# Altium schematic sheet 3_bootleg-2-mcu.SchDoc
size A4
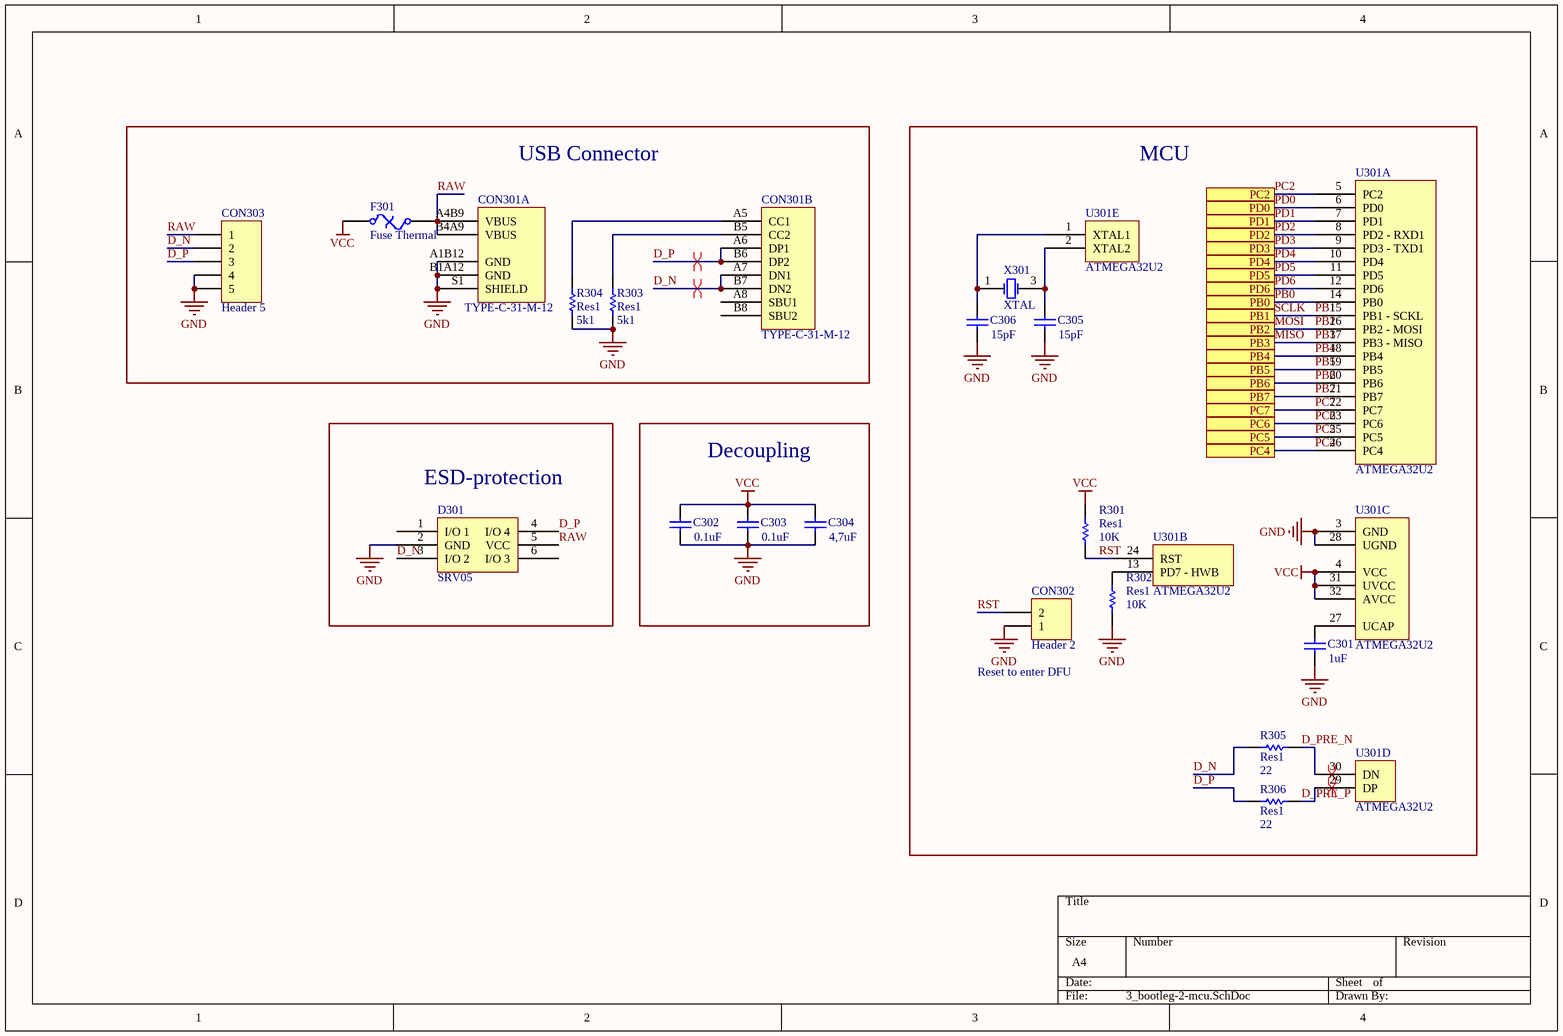
[diagram p0: 3_bootleg-2-mcu.SchDoc]

## Parts
C301  value 1uF  [C0603[1608]]
C302  value 0.1uF  [C0603[1608]]
C303  value 0.1uF  [C0603[1608]]
C304  value 4,7uF  [C0603[1608]]
C305  value 15pF  [C0603[1608]]
C306  value 15pF  [C0603[1608]]
CON301  TYPE-C-31-M-12  [TYPE-C-31-M-12]  (parts A,B of 2)
CON302  Header 2  [HDR1X2]  (no BOM)
CON303  Header 5  [JST SM04B-SRSS-TB]
D301  SRV05  [SOT-23-6]
F301  Fuse Thermal  [C1206[3216]]
R301  Res1  value 10K  [R0603[1608]]
R302  Res1  value 10K  [R0603[1608]]
R303  Res1  value 5k1  [R0603[1608]]
R304  Res1  value 5k1  [R0603[1608]]
R305  Res1  value 22  [R0603[1608]]
R306  Res1  value 22  [R0603[1608]]
U301  ATMEGA32U2  [ATMEGA32U2-COMBO]  (parts A,B,C,D,E of 5)
X301  XTAL  [XTAL-3225]

## Blocks framed on the sheet
USB Connector: CON301 CON303 F301 R303 R304
MCU: C301 C305 C306 CON302 R301 R302 R305 R306 U301 X301
ESD-protection: D301
Decoupling: C302-C304

## Ports
PB0, PB1, PB2, PB3, PB4, PB5, PB6, PB7, PC2, PC4, PC5, PC6, PC7, PD0, PD1, PD2, PD3, PD4, PD5, PD6

## Nets
GND: C301.1 C302.1 C303.1 C304.1 C305.1 C306.1 CON301.A1B12(GND) CON301.B1A12(GND) CON301.S1(SHIELD) CON302.1 CON303.4 CON303.5 D301.2(GND) R302.2 R303.2 R304.2 U301.3(GND) U301.28(UGND) X301.2(GND) X301.4(GND)
VCC: C302.2 C303.2 C304.2 F301.1 R301.1 U301.4(VCC) U301.31(UVCC) U301.32(AVCC)
D_N: CON301.A7(DN1) CON301.B7(DN2) CON303.2 D301.3(I/O_2) R305.2
D_P: CON301.A6(DP1) CON301.B6(DP2) CON303.3 D301.4(I/O_4) R306.2
D_PRE_N: R305.1 U301.30(DN)
D_PRE_P: R306.1 U301.29(DP)
MISO: U301.17(PB3_-_MISO) ; port PB3  [also labelled PB3]
MOSI: U301.16(PB2_-_MOSI) ; port PB2  [also labelled PB2]
PB0: U301.14(PB0) ; port PB0
PB1: U301.15(PB1_-_SCKL) ; port PB1  [also labelled SCLK]
PB4: U301.18(PB4) ; port PB4
PB5: U301.19(PB5) ; port PB5
PB6: U301.20(PB6) ; port PB6
PB7: U301.21(PB7) ; port PB7
PC2: U301.5(PC2) ; port PC2
PC4: U301.26(PC4) ; port PC4
PC5: U301.25(PC5) ; port PC5
PC6: U301.23(PC6) ; port PC6
PC7: U301.22(PC7) ; port PC7
PD0: U301.6(PD0) ; port PD0
PD1: U301.7(PD1) ; port PD1
PD2: U301.8(PD2_-_RXD1) ; port PD2
PD3: U301.9(PD3_-_TXD1) ; port PD3
PD4: U301.10(PD4) ; port PD4
PD5: U301.11(PD5) ; port PD5
PD6: U301.12(PD6) ; port PD6
RAW: CON301.A4B9(VBUS) CON301.B4A9(VBUS) CON303.1 D301.5(VCC) F301.2
RST: CON302.2 R301.2 U301.24(RST)
NetC301_2: C301.2 U301.27(UCAP)
NetC305_2: C305.2 U301.2(XTAL2) X301.3(OSC2)
NetC306_2: C306.2 U301.1(XTAL1) X301.1(OSC1)
NetCON301_A5: CON301.A5(CC1) R304.1
NetCON301_B5: CON301.B5(CC2) R303.1
NetR302_1: R302.1 U301.13(PD7_-_HWB)

Not connected (* = marked no-connect by the designer): CON301 A8(SBU1) B8(SBU2); D301 1(I/O_1) 6(I/O_3)

## Layout directives
differential pair: D_N, D_P, D_PRE_N, D_PRE_P

## Notes on the sheet
- Reset to enter DFU

## Library data of the parts
C301 = Cap: Capacitor; MRF.Part: CL10A105KB8NNNC; MFG: KEMET; MFGPN: C0603C104M5RACTU; LCSC MFG: Samsung Electro-Mechanics; Version: 0603 imperial; LCSC Part #: C15849
C302 C303 = Cap: Capacitor; MRF.Part: CC0603KRX7R9BB104; MFG: KEMET; MFGPN: C0603C104M5RACTU; LCSC MFG: YAGEO; Version: 0603 imperial; LCSC Part #: C14663
C304 = Cap: Capacitor; MRF.Part: CL10A475KO8NNNC; LCSC MFG: Samsung Electro-Mechanics; LCSC Part #: C19666
C305 C306 = Cap: Capacitor; MRF.Part: CL10C150JB8NNNC; LCSC MFG: Samsung Electro-Mechanics; Version: 0603 imperial; LCSC Part #: C1644
CON301 = TYPE-C-31-M-12: MFG: Korean Hroparts Elec; MFGPN: TYPE-C-31-M-12; LCSC Part #: C165948; LCSC MFG: Korean Hroparts Elec; MRF.Part: TYPE-C-31-M-12
CON302 = Header 2: Header, 2-Pin
CON303 = Header 5: JST for USB daughter board; MFGPN: SM04B-SRSS-TB(LF)(SN); MFG: JST Sales America Inc.; LCSC MFG: JST Sales America; LCSC Part #: C160404; MRF.Part: SM04B-SRSS-TB(LF)(SN)
D301 = SRV05: MRF.Part: SRV05-4-P-T7; LCSC MFG: ProTek Devices; LCSC Part #: C85364
F301 = Fuse Thermal: Thermal Fuse; MRF.Part: ASMD1206-050; MFG: Bel Fuse Inc.; MFGPN: 0ZCJ0050FF2G; LCSC MFG: Shenzhen JDT Fuse; LCSC Part #: C135338
R301 R302 = Res1: Resistor; MRF.Part: 0603WAF1002T5E; MFG: Panasonic Electronic Components; MFGPN: ERJ-3EKF5101V; LCSC MFG: Uniroyal Elec; Version: 0603 imperial; LCSC Part #: C25804
R303 R304 = Res1: Resistor; MRF.Part: 0603WAF5101T5E; MFG: Panasonic Electronic Components; MFGPN: ERJ-3EKF5101V; LCSC MFG: Uniroyal Elec; Version: 0603 imperial; LCSC Part #: C23186
R305 R306 = Res1: Resistor; MRF.Part: 0603WAF220JT5E; MFG: Panasonic Electronic Components; MFGPN: ERJ-3EKF5101V; LCSC MFG: Uniroyal Elec; Version: 0603 imperial; LCSC Part #: C23345
U301 = ATMEGA32U2: MRF.Part: ATMEGA32U2-MU; MFG: Microchip Technology; MFGPN: ATMEGA32U2-AUR; LCSC MFG: Microchip Tech; LCSC Part #: C57345
X301 = XTAL: Crystal Oscillator; MRF.Part: X322516MLB4SI; LCSC MFG: Yangxing Tech; LCSC Part #: C13738